# Altium schematic sheet Upstream.SchDoc: = Title
size 431 x 279 mm; Revision: v1.0; SheetNumber: 3; SheetTotal: 7
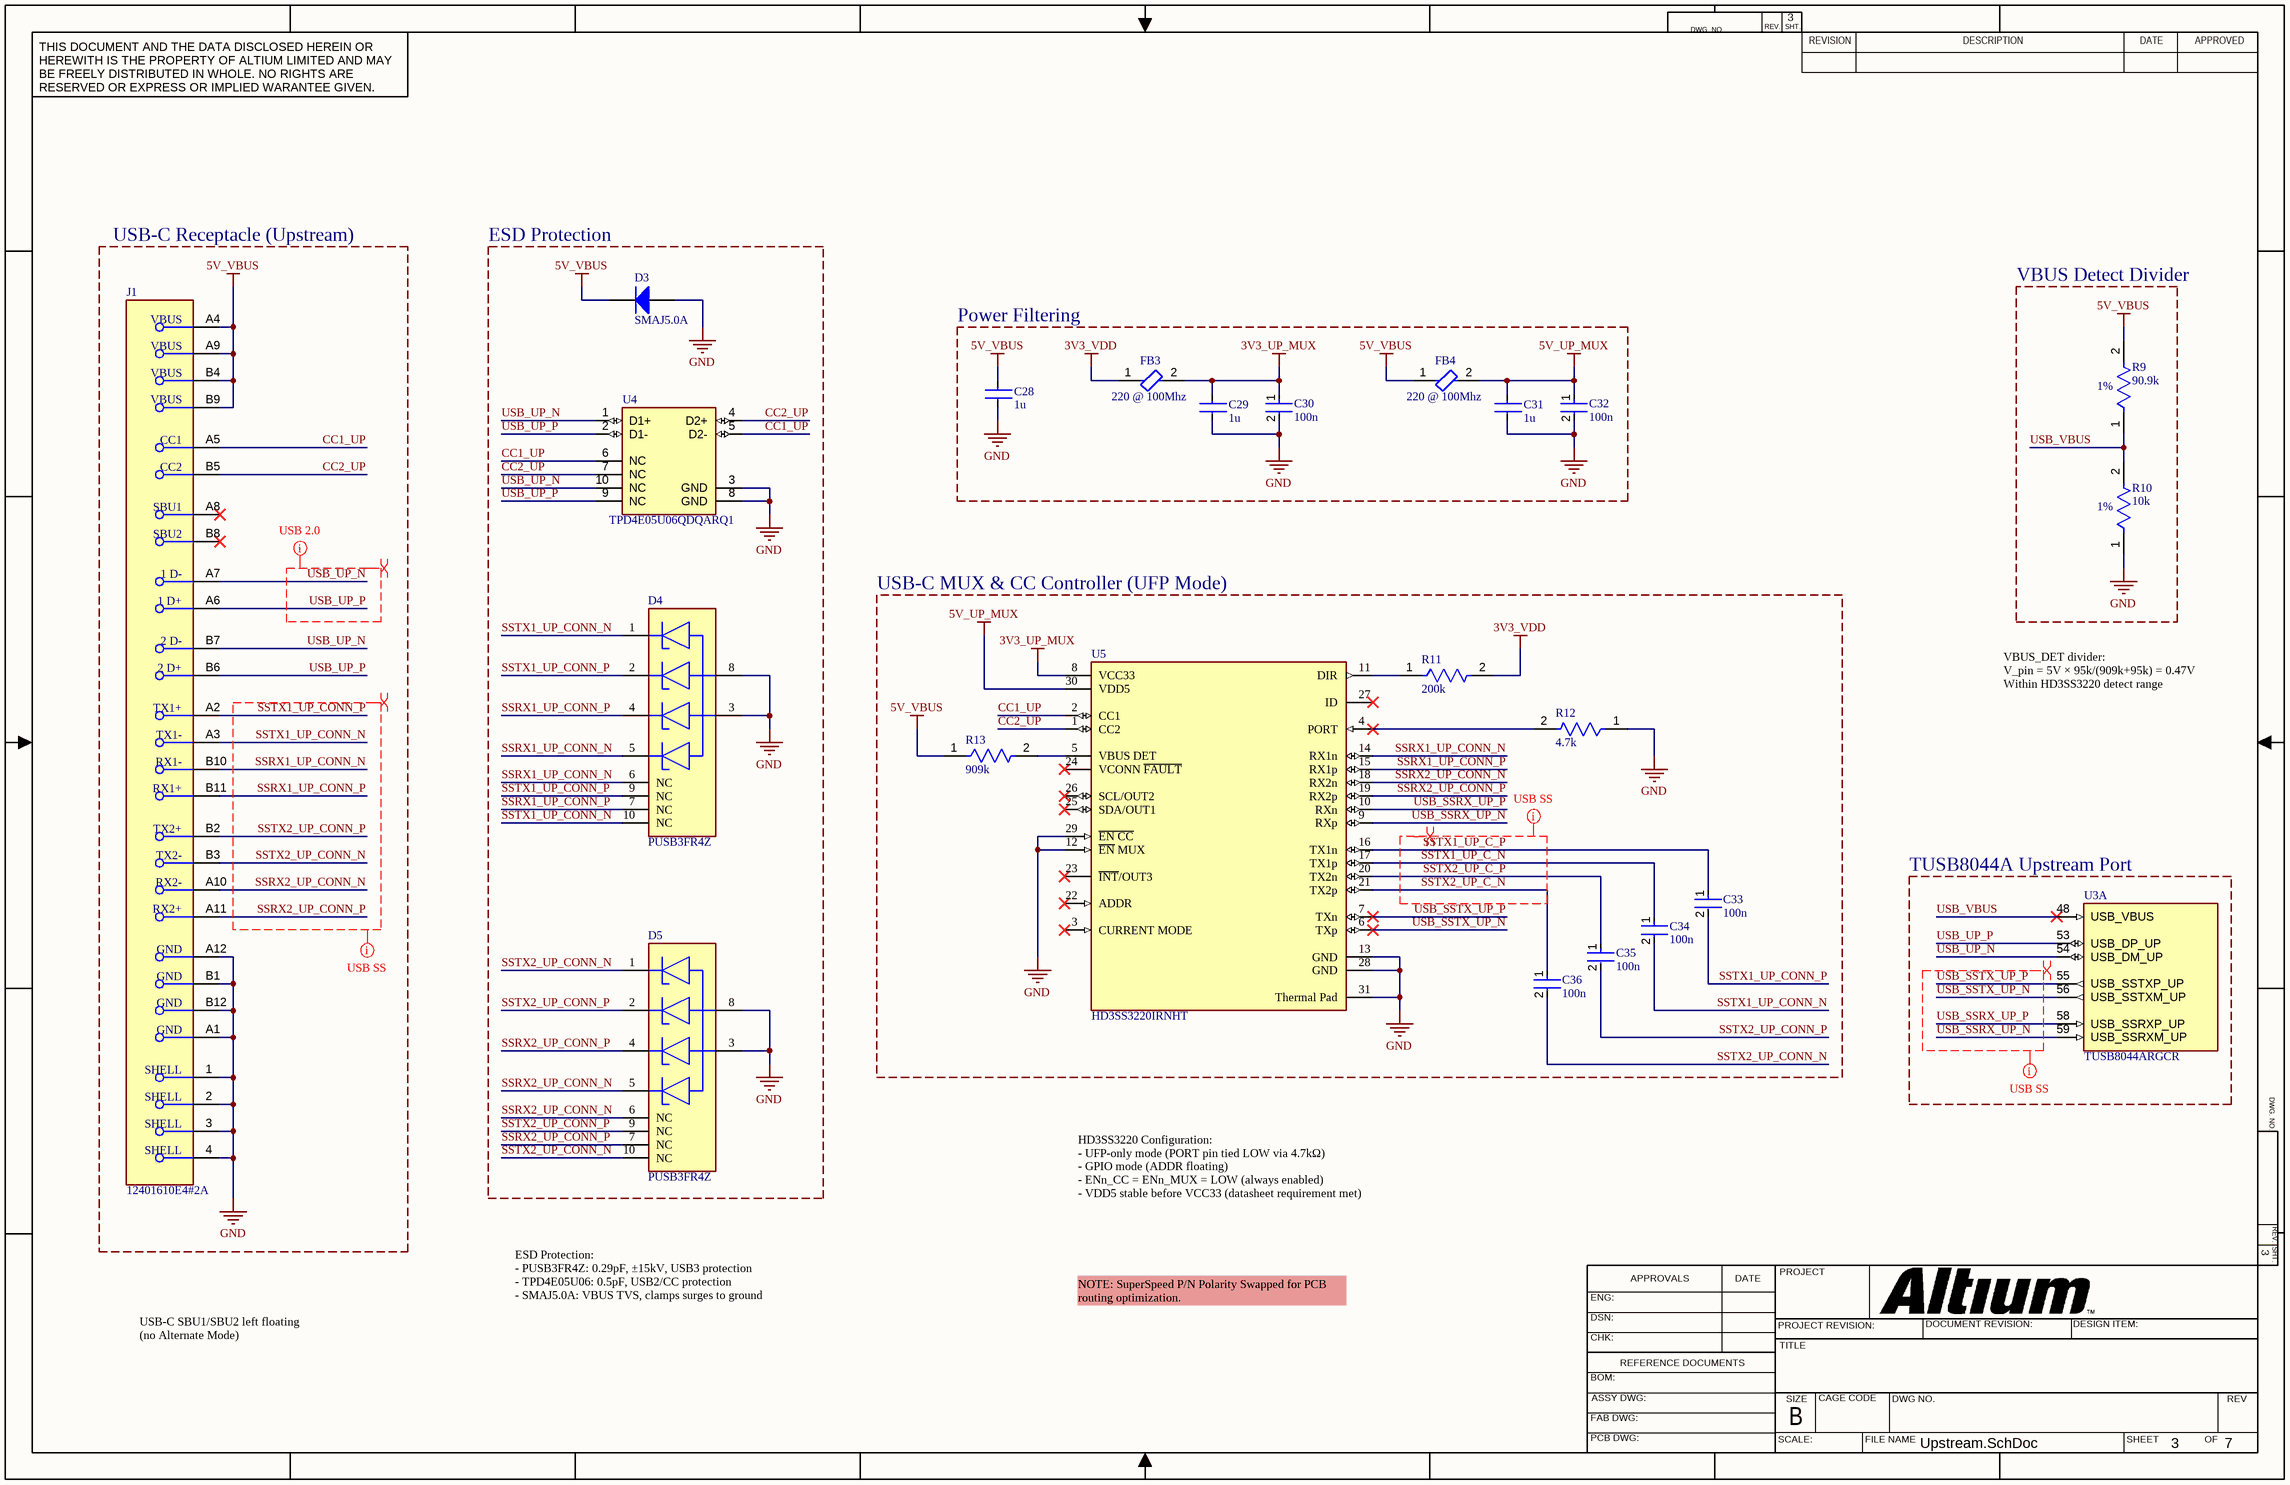
[diagram p0: Upstream.SchDoc]

## Parts
C28  1u  [CAPC1608X90N]
C29  1u  [CAPC1608X90N]
C30  100n  [FP-GRT155-0_05-IPC_C]
C31  1u  [CAPC1608X90N]
C32  100n  [FP-GRT155-0_05-IPC_C]
C33  100n  [FP-GRT155-0_05-IPC_C]
C34  100n  [FP-GRT155-0_05-IPC_C]
C35  100n  [FP-GRT155-0_05-IPC_C]
C36  100n  [FP-GRT155-0_05-IPC_C]
D3  SMAJ5.0A  [BOUR-SMA-2_V]
D4  PUSB3FR4Z  [FP-SOT1176-1-MFG]
D5  PUSB3FR4Z  [FP-SOT1176-1-MFG]
FB3  220 @ 100Mhz  [FP-BLM21-0_2-t0_85-e0_5-IPC_B]
FB4  220 @ 100Mhz  [FP-BLM21-0_2-t0_85-e0_5-IPC_B]
J1  12401610E4#2A  [FP-12401610E4#2A-MFG]
R9  90.9k  [FP-AC0402-MFG]
R10  10k  [FP-AC0402-MFG]
R11  200k  [FP-AC0402-MFG]
R12  4.7k  [FP-AC0402-MFG]
R13  909k  [FP-AC0402-IPC_A]
U3  TUSB8044ARGCR  [QFN50P900X900X100-65N-D]  (part A of 6)
U4  TPD4E05U06QDQARQ1  [FP-DQA0010A-MFG]
U5  HD3SS3220IRNHT  [FP-RNH0030A-MFG]

## Blocks framed on the sheet
USB-C Receptacle (Upstream): J1
ESD Protection: D3-D5 U4
Power Filtering: C28-C32 FB3 FB4
VBUS Detect Divider: R9 R10
USB-C MUX & CC Controller (UFP Mode): C33-C36 R11-R13 U5
TUSB8044A Upstream Port: U3

## Nets
3V3_UP_MUX: C29.2 C30.1 FB3.2 U5.8(VCC33)
3V3_VDD: FB3.1 R11.2
5V_UP_MUX: C31.2 C32.1 FB4.2 U5.30(VDD5)
5V_VBUS: C28.2 D3.2(K) FB4.1 J1.A4(VBUS) J1.A9(VBUS) J1.B4(VBUS) J1.B9(VBUS) R9.2 R13.1
GND: C28.1 C29.1 C30.2 C31.1 C32.2 D3.1(A) D4.3(GND) D4.8(GND) D5.3(GND) D5.8(GND) J1.1(SHELL) J1.2(SHELL) J1.3(SHELL) J1.4(SHELL) J1.A1(GND) J1.A12(GND) J1.B1(GND) J1.B12(GND) R10.1 R12.1 U4.3(GND) U4.8(GND) U5.12(~{EN}_MUX) U5.13(GND) U5.28(GND) U5.29(~{EN_CC}) U5.31(Thermal_Pad)
CC1_UP: J1.A5(CC1) U4.5(D2-) U4.6(NC) U5.2(CC1)
CC2_UP: J1.B5(CC2) U4.4(D2+) U4.7(NC) U5.1(CC2)
SSRX1_UP_CONN_N: D4.5(CH4) D4.6(NC) J1.B10(RX1-) U5.14(RX1n)
SSRX1_UP_CONN_P: D4.4(CH3) D4.7(NC) J1.B11(RX1+) U5.15(RX1p)
SSRX2_UP_CONN_N: D5.5(CH4) D5.6(NC) J1.A10(RX2-) U5.18(RX2n)
SSRX2_UP_CONN_P: D5.4(CH3) D5.7(NC) J1.A11(RX2+) U5.19(RX2p)
SSTX1_UP_C_N: C34.1 U5.17(TX1p)
SSTX1_UP_C_P: C33.1 U5.16(TX1n)
SSTX1_UP_CONN_N: C34.2 D4.1(CH1) D4.10(NC) J1.A3(TX1-)
SSTX1_UP_CONN_P: C33.2 D4.2(CH2) D4.9(NC) J1.A2(TX1+)
SSTX2_UP_C_N: C36.1 U5.21(TX2p)
SSTX2_UP_C_P: C35.1 U5.20(TX2n)
SSTX2_UP_CONN_N: C36.2 D5.1(CH1) D5.10(NC) J1.B3(TX2-)
SSTX2_UP_CONN_P: C35.2 D5.2(CH2) D5.9(NC) J1.B2(TX2+)
USB_SSRX_UP_N: U3.59(USB_SSRXM_UP) U5.9(RXp)
USB_SSRX_UP_P: U3.58(USB_SSRXP_UP) U5.10(RXn)
USB_SSTX_UP_N: U3.56(USB_SSTXM_UP) U5.6(TXp)
USB_SSTX_UP_P: U3.55(USB_SSTXP_UP) U5.7(TXn)
USB_UP_N: J1.A7(1_D-) J1.B7(2_D-) U3.54(USB_DM_UP) U4.1(D1+) U4.10(NC)
USB_UP_P: J1.A6(1_D+) J1.B6(2_D+) U3.53(USB_DP_UP) U4.2(D1-) U4.9(NC)
USB_VBUS: R9.1 R10.2 U3.48(USB_VBUS)
NetR11_1: R11.1 U5.11(DIR)
NetR12_2: R12.2 U5.4(PORT)
NetR13_2: R13.2 U5.5(VBUS_DET)

Not connected (* = marked no-connect by the designer): J1 A8(SBU1)* B8(SBU2)*; U5 3(CURRENT_MODE)* 22(ADDR)* 23(~{INT}/OUT3)* 24(VCONN_~{FAULT})* 25(SDA/OUT1)* 26(SCL/OUT2)* 27(ID)*

## Layout directives
differential pair: SSRX1_UP_CONN_N, SSRX1_UP_CONN_P, SSRX2_UP_CONN_N, SSRX2_UP_CONN_P, SSTX1_UP_C_N, SSTX1_UP_C_P, SSTX1_UP_CONN_N, SSTX1_UP_CONN_P, SSTX2_UP_C_N, SSTX2_UP_C_P, SSTX2_UP_CONN_N, SSTX2_UP_CONN_P, USB_SSRX_UP_N, USB_SSRX_UP_P, USB_SSTX_UP_N, USB_SSTX_UP_P, USB_UP_N, USB_UP_P
net class USB_SuperSpeed: SSRX1_UP_CONN_N, SSRX1_UP_CONN_P, SSRX2_UP_CONN_N, SSRX2_UP_CONN_P, SSTX1_UP_C_N, SSTX1_UP_C_P, SSTX1_UP_CONN_N, SSTX1_UP_CONN_P, SSTX2_UP_C_N, SSTX2_UP_C_P, SSTX2_UP_CONN_N, SSTX2_UP_CONN_P, USB_SSRX_UP_N, USB_SSRX_UP_P, USB_SSTX_UP_N, USB_SSTX_UP_P
net class USB_HighSpeed: USB_UP_N, USB_UP_P

## Notes on the sheet
- (near R9) 1%
- (near R10) 1%
- VBUS_DET divider:
  V_pin = 5V × 95k/(909k+95k) = 0.47V
  Within HD3SS3220 detect range
- HD3SS3220 Configuration:
  - UFP-only mode (PORT pin tied LOW via 4.7kΩ)
  - GPIO mode (ADDR floating)
  - ENn_CC = ENn_MUX = LOW (always enabled)
  - VDD5 stable before VCC33 (datasheet requirement met)
- NOTE: SuperSpeed P/N Polarity Swapped for PCB routing optimization.
- USB-C SBU1/SBU2 left floating
  (no Alternate Mode)
- ESD Protection:
  - PUSB3FR4Z: 0.29pF, ±15kV, USB3 protection
  - TPD4E05U06: 0.5pF, USB2/CC protection
  - SMAJ5.0A: VBUS TVS, clamps surges to ground
- DWG. NO.
- REV.
- SHT.
- THIS DOCUMENT AND THE DATA DISCLOSED HEREIN OR HEREWITH IS THE PROPERTY OF ALTIUM LIMITED AND MAY BE FREELY DISTRIBUTED IN WHOLE. NO RIGHTS ARE RESERVED OR EXPRESS OR IMPLIED WARANTEE GIVEN.
- REVISION
- DESCRIPTION
- DATE
- APPROVED
- ENG:
- APPROVALS
- PROJECT
- DSN:
- CHK:
- REFERENCE DOCUMENTS
- PROJECT REVISION:
- TITLE
- DOCUMENT REVISION:
- DESIGN ITEM:
- BOM:
- FAB DWG:
- PCB DWG:
- ASSY DWG:
- SCALE:
- SIZE
- B
- CAGE CODE
- FILE NAME
- DWG NO.
- SHEET
- OF
- REV

## Library data of the parts
C28 C29 C31 = C1608X7R1H105K080AB: The superior mechanical strength and reliability due to the monolithic structure.  Low ESR, ESL and excellent frequency characteristics allow for a circuit design that closely conforms to theoretical values.  Low self-heating and high ripple resistance due to low ESR.  No polarity; Manufacturer_Name: TDK; Geometry.Height: 0.9mm; Mouser Part Number: 810-C1608X7R1H105K08; Mouser Price/Stock: https://www.mouser.co.uk/ProductDetail/TDK/C1608X7R1H105K080AB?qs=efUn273yAhdzCWVW9RXgig%3D%3D; Manufacturer_Part_Number: C1608X7R1H105K080AB; Datasheet Link: https://media.digikey.com/pdf/Data%20Sheets/TDK%20PDFs/mlcc_commercial_general_Rev2018.pdf
C30 C32-C36 = CMP-06035-030480-1: Multi-Layer Ceramic Capacitor 100nF 50V X7R ±10% 0402 Paper T/R
D3 = CMP-2000-07090-1: SMAJ Transient Voltage Suppressor Diode Series, 3.5 V, -55 to 150 degC, 2-Pin SMA, RoHS, Tape and Reel; Manufacturer: Bourns; EDA / CAD Models: DownloadfromAcceleratedDesigns; Unidirectional Channels: 1; Voltage - Breakdown (Min): 6.4V; Voltage - Reverse Standoff (Typ): 5V; Voltage - Clamping (Max) @ Ipp: 9.2V; Other Names: SMAJ5.0ABDKR; Type: Zener; Catalog Drawings: SMAJSeriesFootprintSMAJ,SMBJSeries; Featured Product: SMAJ/SMBJ/SMCJ/SMLJDiscreteTVSDiodes; Power - Peak Pulse: 400W; Current - Peak Pulse (10/1000µs): 43.5A; Power Line Protection: No; Online Catalog: SMAJSeries; Supplier Device Package: SMA(DO-214AC); Operating Temperature: -55°C~150°C(TJ); Package Description: 2-Pin Surface Mount Device, Body 4.315 x 2.605 mm; Datasheet URL: https://datasheet.ciiva.com/25624/0900766b8112213b-25624680.pdf; Manufacturer URL: http://www.bourns.com/; Datasheet Version: 08/2012; Series: SMAJ; Family: TVS-Diodes; Bidirectional Channels: -; Applications: GeneralPurpose; Package Reference: SMA-2; Standard Package: 1; Package / Case: DO-214AC,SMA; Category: CircuitProtection; RoHS Information: SMAJSeriesMaterialDeclaration; Mounting Technology: SurfaceMount; Capacitance @ Frequency: -; Packaging: Digi-Reel®; Mounting Type: SurfaceMount
D4 D5 = CMP-14432-000005-1: TVS DIODE 3.3VWM 3VC DFN2510A-10; RoHS Compliant: Yes
FB3 FB4 = CMP-0686-00610-3: Chip Ferrite Bead, 0805, 220Ω @ 100MHz, 0.045Ω, 25%, 2A; Number of Circuits: 1; Shielding: Unshielded; DC Resistance (DCR): 45mR; Impedance: 220R; Radiation Hardening: No; Material: Ferrite; Frequency: 100MHz; Width: 1.25mm; DC Current: 2A; Max DC Current: 2A; Number of Lines: 1; Package Quantity: 1; Case Code (Metric): 2012; Current Rating: 2A; Case/Package: 0805; Current: 2A; Military Standard: Not; Core Material: Ferrite; Depth: 1.25mm; Contact Plating: Tin; DC Resistance-Max: 45mR; Max Operating Temperature: 125°C; Length: 2mm; Max Current Rating: 2A; REACH SVHC: No SVHC; Termination: SMD/SMT; Min Operating Temperature: -55°C; Series: BLM21P; Test Frequency: 100MHz; Tolerance: 25%; Number of Pins: 2; RoHS Compliant: Yes; Height: 0.85mm; Packaging: Tape and Reel; Lead Free: Lead Free; Case Code (Imperial): 0805
J1 = CMP-02355-000003-1: CONN RCP USB3.1 TYPEC 24P SMD RA; Connector Type: USB; Number of Contacts: 24; Gender: Receptacle; Packaging: Cut Tape; Mount: Surface Mount; Number of Pins: 24
R9 = CMP-03412-009342-2: RES 90.9kΩ ±1% 0.063W 0402; Voltage Rating: 50V; Resistance: 90.9kR; Temperature Coefficient: 100ppm/°C; Max Power Dissipation: 63mW; Power Rating: 62.5mW; Resistor Type: Thick Film; Length: 0.039inch; RoHS Compliant: Yes; Features: Moisture Resistant; Height: 0.015inch; Case Code (Imperial): 0402; Tolerance: 1%; Min Operating Temperature: -55°C; Case/Package: 0402; Width: 0.5mm; Series: AC; Termination: SMD/SMT; Number of Terminations: 2; Max Operating Temperature: 155°C; Case Code (Metric): 1005; Packaging: Tape and Reel
R10 = CMP-2002-01790-3: RES 10kΩ ±1% 0.063W 0402; Power Rating: 62.5mW; Voltage Rating: 50V; Temperature Coefficient: 100ppm/°C; Resistance: 10kR; Max Power Dissipation: 63mW; Tolerance: 1%; Military Standard: Not; Construction: Rectangular; Termination: SMD/SMT; Max Operating Temperature: 155°C; Min Operating Temperature: -55°C; Height: 0.015inch; Lead Free: Lead Free; Width: 0.02inch; Case/Package: 0402; Resistor Type: Thick Film; Series: AC; Features: Moisture Resistant; RoHS Compliant: Yes; Number of Terminations: 2; Case Code (Metric): 1005; Length: 0.039inch; Depth: 0.5mm; Size Code: 0402; Packaging: Tape and Reel; Case Code (Imperial): 0402
R11 = CMP-03412-002362-2: RES 200kΩ ±1% 0.063W 0402; Temperature Coefficient: 100ppm/°C; Voltage Rating: 50V; Max Power Dissipation: 63mW; Power Rating: 62.5mW; Resistance: 200kR; RoHS Compliant: Yes; Series: AC; Height: 0.015inch; Termination: SMD/SMT; Case Code (Imperial): 0402; Min Operating Temperature: -55°C; Weight: 2.3E-05oz; Case Code (Metric): 1005; Case/Package: 0402; Max Operating Temperature: 155°C; Width: 0.5mm; Size Code: 0402; Features: Moisture Resistant; Number of Terminations: 2; Tolerance: 1%; Packaging: Tape and Reel; Lead Free: Lead Free; Resistor Type: Thick Film; Length: 0.039inch
R12 = CMP-03412-009386-2: RES 4.7kΩ ±1% 0.063W 0402
R13 = CMP-03412-019105-2: RES 909kΩ ±1% 0.063W 0402; Power Rating: 62.5mW; Voltage Rating: 50V; Resistance: 909kR; Temperature Coefficient: 100ppm/°C; Max Power Dissipation: 63mW; Number of Terminations: 2; Packaging: Tape and Reel; Height: 0.015inch; Max Operating Temperature: 155°C; Series: AC; Resistor Type: Thick Film; Features: Moisture Resistant; Width: 0.5mm; RoHS Compliant: Yes; Length: 0.039inch; Case/Package: 0402; Min Operating Temperature: -55°C; Tolerance: 1%; Termination: SMD/SMT; Case Code (Imperial): 0402; Case Code (Metric): 1005
U3 = TUSB8044ARGCR: Four-port USB 3.2 x1 Gen1 hub with USB billboard; Manufacturer_Name: Texas Instruments; Geometry.Height: 1mm; Mouser Part Number: 595-TUSB8044ARGCR; Mouser Price/Stock: https://www.mouser.co.uk/ProductDetail/Texas-Instruments/TUSB8044ARGCR?qs=9r4v7xj2LnlTBCFutY1Bfg%3D%3D; Manufacturer_Part_Number: TUSB8044ARGCR; Datasheet Link: http://www.ti.com/lit/gpn/TUSB8044A
U4 = CMP-04985-000004-1: TVS DIODE 5.5V 14V 10USON; Manufacturer: Texas Instruments; Direction: Unidirectional; Standoff Height: 0mm; Capacitance: 0.5pF; Number Of Channels: 4; Breakdown Voltage: 6.4V; Peak Pulse Power: 2.5W; Automotive Grade: Grade 1; Value: 0.5pF; Interface: USB,Ethernet,LVDS,Other; Peak Pulse Current: 2.5A; Operating Supply Voltage: 5.5V; Reverse Standoff Voltage: 5.5V; Package: DQA0010A; Temperature Range Low: -40°C; Temperature Range High: +125°C; Ambient Temperature Range Low: -40°C; Device Class L1: Circuit Protection; Clamping Voltage: 14V; Manufacturer Part Number: TPD4E05U06QDQARQ1; Device Class L2: ESD and Circuit Protection ICs; Octopart: https://octopart.com/tpd4e05u06qdqarq1-texas+instruments-48523459; Device Class L3: unset; Height: 0.55mm; Automotive: Yes; ComponentLink2Description: Datasheet; RoHS: TRUE; Ambient Temperature Range High: +125°C; Category: IC; Mouser Description: Automotive 4-Channel ESD Protection Solution for SuperSpeed (up to 5 Gbps) Interface 10-USON -40 to 125; Temperature: -40°C to +125°C; ComponentLink2URL: http://www.ti.com/lit/ds/symlink/tpd4e05u06-q1.pdf; Digikey Description: TVS DIODE 5.5V 14V 10USON; Lead Free: Yes
U5 = CMP-04877-000019-1: USB TYPE-C DRP PORT CONTROLLER W; Max Supply Voltage: 5.5V; Min Supply Voltage: 3V; Number of Ports: 1; Data Rate: 10Gbps; USB Standard: USB 3.1; Mount: Surface Mount; Max Operating Temperature: 70°C; Lead Free: Lead Free; RoHS Compliant: Yes; Packaging: Tape and Reel; Number of Pins: 30; Min Operating Temperature: 0°C; REACH SVHC: No SVHC